# EAGLE schematic potentiomer_matrix (EAGLE 9.6.0)
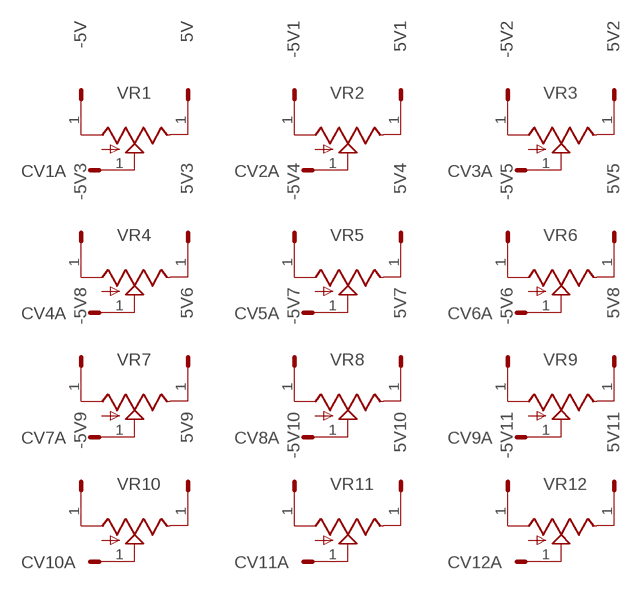
[diagram p0: schematic, sheet 1]

## Parts
5V  HEADER/MALE/01  [HEADER/MALE/01]
5V1  HEADER/MALE/01  [HEADER/MALE/01]
5V2  HEADER/MALE/01  [HEADER/MALE/01]
5V3  HEADER/MALE/01  [HEADER/MALE/01]
5V4  HEADER/MALE/01  [HEADER/MALE/01]
5V5  HEADER/MALE/01  [HEADER/MALE/01]
5V6  HEADER/MALE/01  [HEADER/MALE/01]
5V7  HEADER/MALE/01  [HEADER/MALE/01]
5V8  HEADER/MALE/01  [HEADER/MALE/01]
5V9  HEADER/MALE/01  [HEADER/MALE/01]
5V10  HEADER/MALE/01  [HEADER/MALE/01]
5V11  HEADER/MALE/01  [HEADER/MALE/01]
-5V  HEADER/MALE/01  [HEADER/MALE/01]
-5V1  HEADER/MALE/01  [HEADER/MALE/01]
-5V2  HEADER/MALE/01  [HEADER/MALE/01]
-5V3  HEADER/MALE/01  [HEADER/MALE/01]
-5V4  HEADER/MALE/01  [HEADER/MALE/01]
-5V5  HEADER/MALE/01  [HEADER/MALE/01]
-5V6  HEADER/MALE/01  [HEADER/MALE/01]
-5V7  HEADER/MALE/01  [HEADER/MALE/01]
-5V8  HEADER/MALE/01  [HEADER/MALE/01]
-5V9  HEADER/MALE/01  [HEADER/MALE/01]
-5V10  HEADER/MALE/01  [HEADER/MALE/01]
-5V11  HEADER/MALE/01  [HEADER/MALE/01]
CV1A  HEADER/MALE/01  [HEADER/MALE/01]
CV2A  HEADER/MALE/01  [HEADER/MALE/01]
CV3A  HEADER/MALE/01  [HEADER/MALE/01]
CV4A  HEADER/MALE/01  [HEADER/MALE/01]
CV5A  HEADER/MALE/01  [HEADER/MALE/01]
CV6A  HEADER/MALE/01  [HEADER/MALE/01]
CV7A  HEADER/MALE/01  [HEADER/MALE/01]
CV8A  HEADER/MALE/01  [HEADER/MALE/01]
CV9A  HEADER/MALE/01  [HEADER/MALE/01]
CV10A  HEADER/MALE/01  [HEADER/MALE/01]
CV11A  HEADER/MALE/01  [HEADER/MALE/01]
CV12A  HEADER/MALE/01  [HEADER/MALE/01]
VR1  9MM_SNAP-IN_POT_  [9MM_SNAP-IN_POT]
VR2  9MM_SNAP-IN_POT_  [9MM_SNAP-IN_POT]
VR3  9MM_SNAP-IN_POT_  [9MM_SNAP-IN_POT]
VR4  9MM_SNAP-IN_POT_  [9MM_SNAP-IN_POT]
VR5  9MM_SNAP-IN_POT_  [9MM_SNAP-IN_POT]
VR6  9MM_SNAP-IN_POT_  [9MM_SNAP-IN_POT]
VR7  9MM_SNAP-IN_POT_  [9MM_SNAP-IN_POT]
VR8  9MM_SNAP-IN_POT_  [9MM_SNAP-IN_POT]
VR9  9MM_SNAP-IN_POT_  [9MM_SNAP-IN_POT]
VR10  9MM_SNAP-IN_POT_  [9MM_SNAP-IN_POT]
VR11  9MM_SNAP-IN_POT_  [9MM_SNAP-IN_POT]
VR12  9MM_SNAP-IN_POT_  [9MM_SNAP-IN_POT]

## Nets
N$1: 5V.1 VR1.3(E)
N$2: 5V1.1 VR2.3(E)
N$3: 5V2.1 VR3.3(E)
N$4: 5V3.1 VR4.3(E)
N$5: 5V4.1 VR5.3(E)
N$6: 5V5.1 VR6.3(E)
N$7: 5V6.1 VR7.3(E)
N$8: 5V7.1 VR8.3(E)
N$9: CV1A.1 VR1.2(S)
N$10: 5V8.1 VR9.3(E)
N$11: CV2A.1 VR2.2(S)
N$12: 5V9.1 VR10.3(E)
N$13: CV3A.1 VR3.2(S)
N$14: 5V10.1 VR11.3(E)
N$15: CV4A.1 VR4.2(S)
N$16: 5V11.1 VR12.3(E)
N$17: CV5A.1 VR5.2(S)
N$18: -5V1.1 VR2.1(A)
N$19: CV6A.1 VR6.2(S)
N$20: -5V2.1 VR3.1(A)
N$21: CV7A.1 VR7.2(S)
N$22: -5V3.1 VR4.1(A)
N$23: CV8A.1 VR8.2(S)
N$24: -5V4.1 VR5.1(A)
N$25: CV9A.1 VR9.2(S)
N$26: -5V5.1 VR6.1(A)
N$27: CV10A.1 VR10.2(S)
N$28: -5V6.1 VR9.1(A)
N$29: CV11A.1 VR11.2(S)
N$30: -5V.1 VR1.1(A)
N$31: CV12A.1 VR12.2(S)
N$32: -5V7.1 VR8.1(A)
N$33: -5V8.1 VR7.1(A)
N$34: -5V9.1 VR10.1(A)
N$35: -5V10.1 VR11.1(A)
N$36: -5V11.1 VR12.1(A)

## Library data of the parts
5V 5V1-5V11 -5V -5V1--5V11 CV1A CV2A CV3A CV4A CV5A CV6A CV7A CV8A CV9A CV10A CV11A CV12A = connectors:HEADER/MALE/01; SPICEPREFIX: X
VR1-VR12 = controls:9MM_SNAP-IN_POT: 9mm vertical snap-in pot, Alpha / Panasonic style